# EAGLE design BoB_modul (EAGLE 7.4.0)
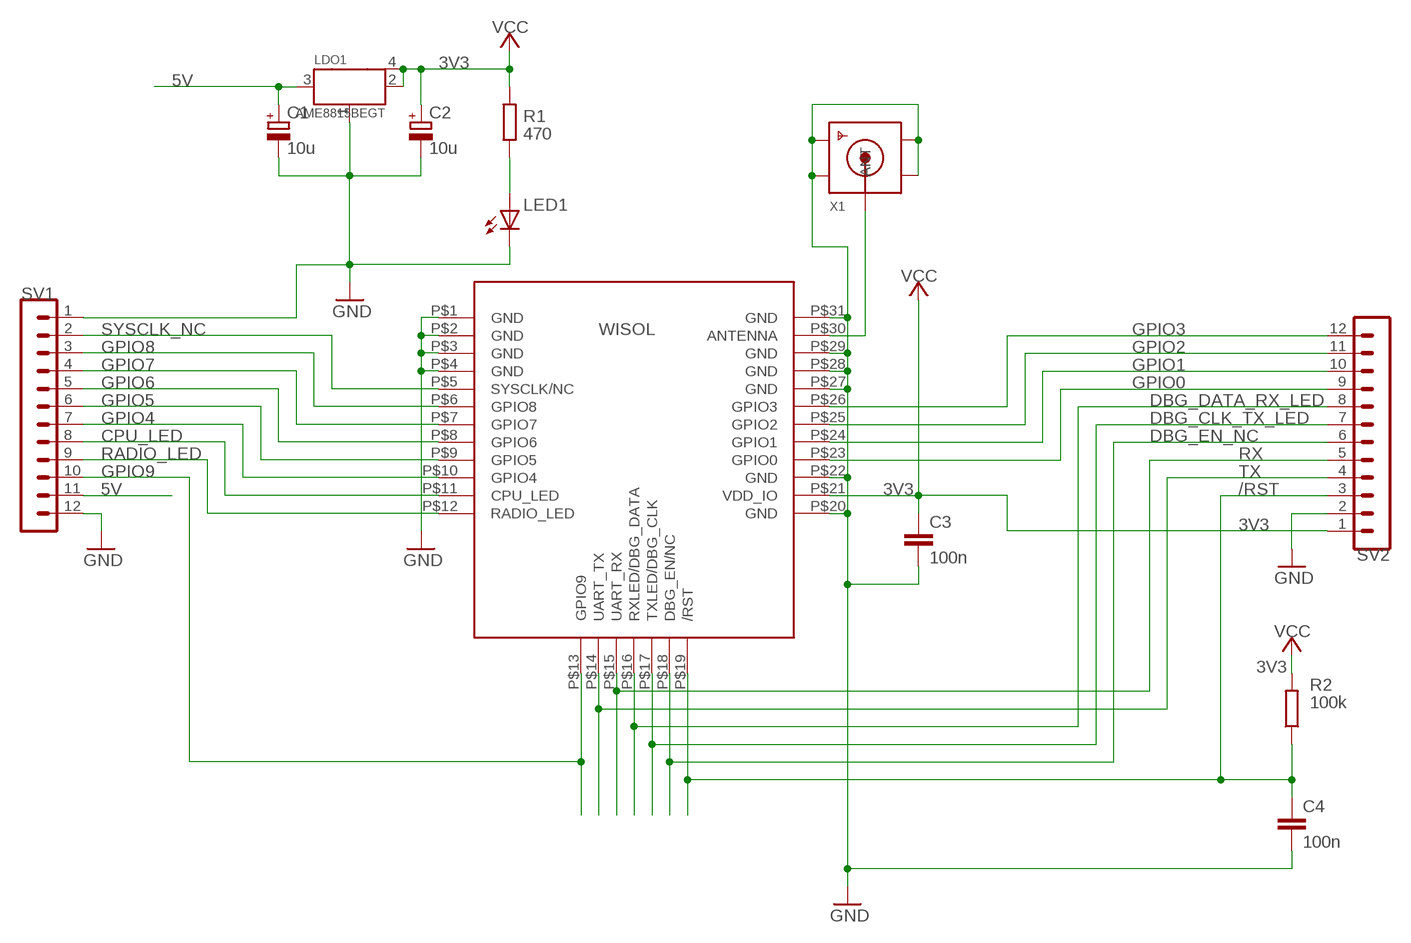
[diagram p0: schematic, sheet 1]

## Parts
C1  10u  CPOL-EUA/3216-18R  [A/3216-18R]
C2  10u  CPOL-EUA/3216-18R  [A/3216-18R]
C3  100n  C-EUC0603K  [C0603K]
C4  100n  C-EUC0603K  [C0603K]
LDO1  AME8815BEGT  [SOT223]
LED1  LEDCHIPLED_0603  [CHIPLED_0603]
R1  470  R-EU_R0603  [R0603]
R2  100k  R-EU_R0603  [R0603]
SV1  MA12-1  [MA12-1]
SV2  MA12-1  [MA12-1]
WSSFM10  SFM10  WSSFM10'HANDSOLDER'  [WSSFM10]
X1  SMACONNECTOR_EDGE_UFL  [SMA_EDGELAUNCH_UFL]

## Nets
3V3: C2.+ C3.1 LDO1.2 LDO1.4 R1.2 R2.2 SV2.1 WSSFM10.P$21(VDD_IO) ; supply symbol labelled VCC
5V: C1.+ LDO1.3 SV1.11
/RST: C4.1 R2.1 SV2.3 WSSFM10.P$19(/RST)
CPU_LED: SV1.8 WSSFM10.P$11(CPU_LED)
DBG_CLK_TX_LED: SV2.7 WSSFM10.P$17(TXLED/DBG_CLK)
DBG_DATA_RX_LED: SV2.8 WSSFM10.P$16(RXLED/DBG_DATA)
DBG_EN_NC: SV2.6 WSSFM10.P$18(DBG_EN/NC)
GND: C1.- C2.- C3.2 C4.2 LDO1.1 LED1.C SV1.1 SV1.12 SV2.2 WSSFM10.P$1(GND) WSSFM10.P$2(GND) WSSFM10.P$3(GND) WSSFM10.P$4(GND) WSSFM10.P$20(GND) WSSFM10.P$22(GND) WSSFM10.P$27(GND) WSSFM10.P$28(GND) WSSFM10.P$29(GND) WSSFM10.P$31(GND) X1.GND@1(GND1) X1.GND@2(GND2) X1.GND@3(GND3) X1.GND@4(GND4)
GPIO0: SV2.9 WSSFM10.P$23(GPIO0)
GPIO1: SV2.10 WSSFM10.P$24(GPIO1)
GPIO2: SV2.11 WSSFM10.P$25(GPIO2)
GPIO3: SV2.12 WSSFM10.P$26(GPIO3)
GPIO4: SV1.7 WSSFM10.P$10(GPIO4)
GPIO5: SV1.6 WSSFM10.P$9(GPIO5)
GPIO6: SV1.5 WSSFM10.P$8(GPIO6)
GPIO7: SV1.4 WSSFM10.P$7(GPIO7)
GPIO8: SV1.3 WSSFM10.P$6(GPIO8)
GPIO9: SV1.10 WSSFM10.P$13(GPIO9)
N$1: LED1.A R1.1
N$2: WSSFM10.P$30(ANTENNA) X1.P(ANT)
RADIO_LED: SV1.9 WSSFM10.P$12(RADIO_LED)
RX: SV2.5 WSSFM10.P$15(UART_RX)
SYSCLK_NC: SV1.2 WSSFM10.P$5(SYSCLK/NC)
TX: SV2.4 WSSFM10.P$14(UART_TX)

## Library data of the parts
C1 C2 = resistor:CPOL-EU: POLARIZED CAPACITOR, European symbol
C3 C4 = resistor:C-EU: CAPACITOR, European symbol
LDO1 = _Jochen_2016-10-02:AME8815BEGT
LED1 = led:LED: LED OSRAM: - CHIPLED LG R971, LG N971, LY N971, LG Q971, LY Q971, LO R971, LY R971 LH N974, LH R974 LS Q976, LO Q976, LY Q976 LO Q996 - Hyper CHIPLED LW Q18S LB Q993, LB Q99A, LB R99A - SideLED LS A670, LO A670, LY A670, LG A670, LP A670 LB A673, LV A673, LT A673, LW A673 LH A674 LY A675 LS A676, LA A676, LO A676, LY A676, LW A676 LS A679, LY A679, LG A679 - Hyper Micro SIDELED® LS Y876, LA Y876, LO Y876, LY Y876 LT Y87S - SmartLED LW L88C, LW L88S LB L89C, LB L89S, LG L890 LS L89K, LO L89K, LY L89K LS L896, LA L896, LO L896, LY L896 - TOPLED LS T670, LO T670, LY T670, LG T670, LP T670 LSG T670, LSP T670, LSY T670, LOP T670, LYG T670 LG T671, LOG T671, LSG T671 LB T673, LV T673, LT T673, LW T673 LH T674 LS T676, LA T676, LO T676, LY T676, LB T676, LH T676, LSB T676, LW T676 LB T67C, LV T67C, LT T67C, LS T67K, LO T67K, LY T67K, LW E67C LS E67B, LA E67B, LO E67B, LY E67B, LB E67C, LV E67C, LT E67C LW T67C LS T679, LY T679, LG T679 LS T770, LO T770, LY T770, LG T770, LP T770 LB T773, LV T773, LT T773, LW T773 LH T774 LS E675, LA E675, LY E675, LS T675 LS T776, LA T776, LO T776, LY T776, LB T776 LHGB T686 LT T68C, LB T68C - Hyper Mini TOPLED® LB M676 - Mini TOPLED Santana® LG M470 LS M47K, LO M47K, LY M47K Source: http://www.osram.convergy.de LUXEON: - LUMILED® LXK2-PW12-R00, LXK2-PW12-S00, LXK2-PW14-U00, LXK2-PW14-V00 LXK2-PM12-R00, LXK2-PM12-S00, LXK2-PM14-U00 LXK2-PE12-Q00, LXK2-PE12-R00, LXK2-PE12-S00, LXK2-PE14-T00, LXK2-PE14-U00 LXK2-PB12-K00, LXK2-PB12-L00, LXK2-PB12-M00, LXK2-PB14-N00, LXK2-PB14-P00, LXK2-PB14-Q00 LXK2-PR12-L00, LXK2-PR12-M00, LXK2-PR14-Q00, LXK2-PR14-R00 LXK2-PD12-Q00, LXK2-PD12-R00, LXK2-PD12-S00 LXK2-PH12-R00, LXK2-PH12-S00 LXK2-PL12-P00, LXK2-PL12-Q00, LXK2-PL12-R00 Source: www.luxeon.com KINGBRIGHT: KA-3528ASYC Source: www.kingbright.com
R1 R2 = resistor:R-EU_: RESISTOR, European symbol
SV1 SV2 = con-lstb:MA12-1: PIN HEADER; OC_FARNELL: unknown; OC_NEWARK: unknown
WSSFM10 = WiSOL:WSSFM10: WiSOL WSSFM10 Sigfox Module with PCB Footprint to enable handsolder
X1 = adafruit_microbuilder:SMACONNECTOR: SMA Connector 90° DIP SMA Connector, 50 Ohm (4UConnector: 07259)

## Board
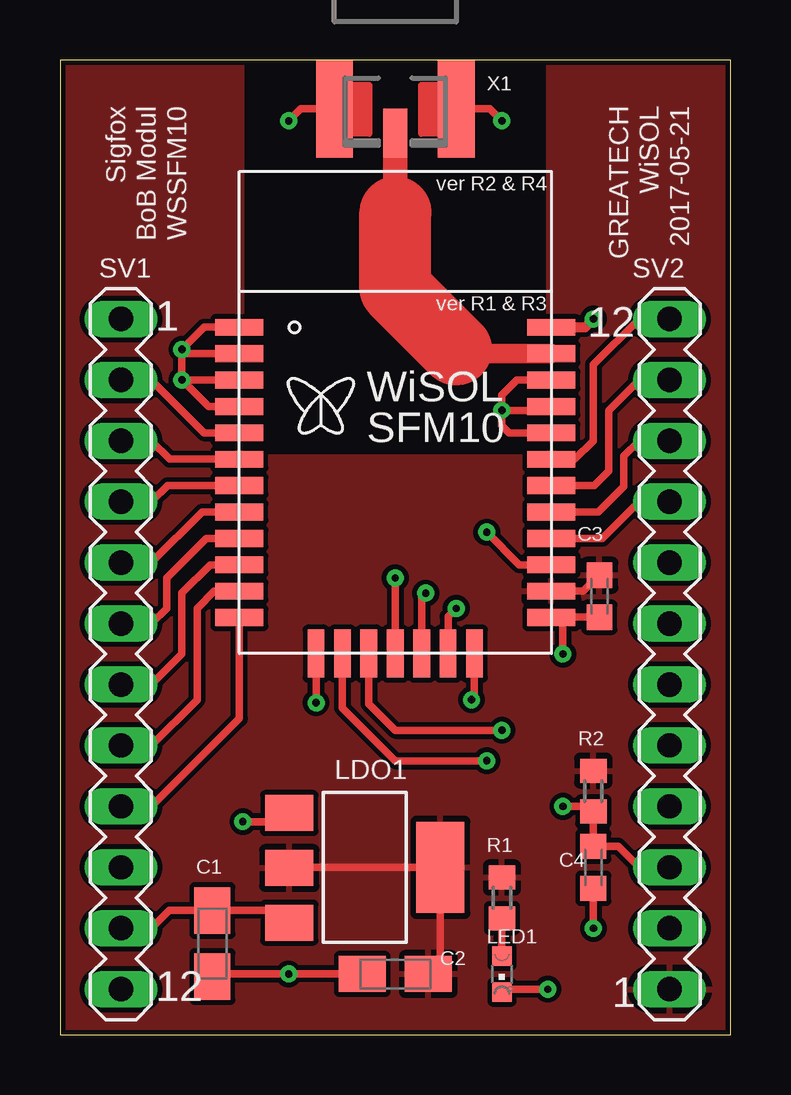
[diagram p1: board, top side]
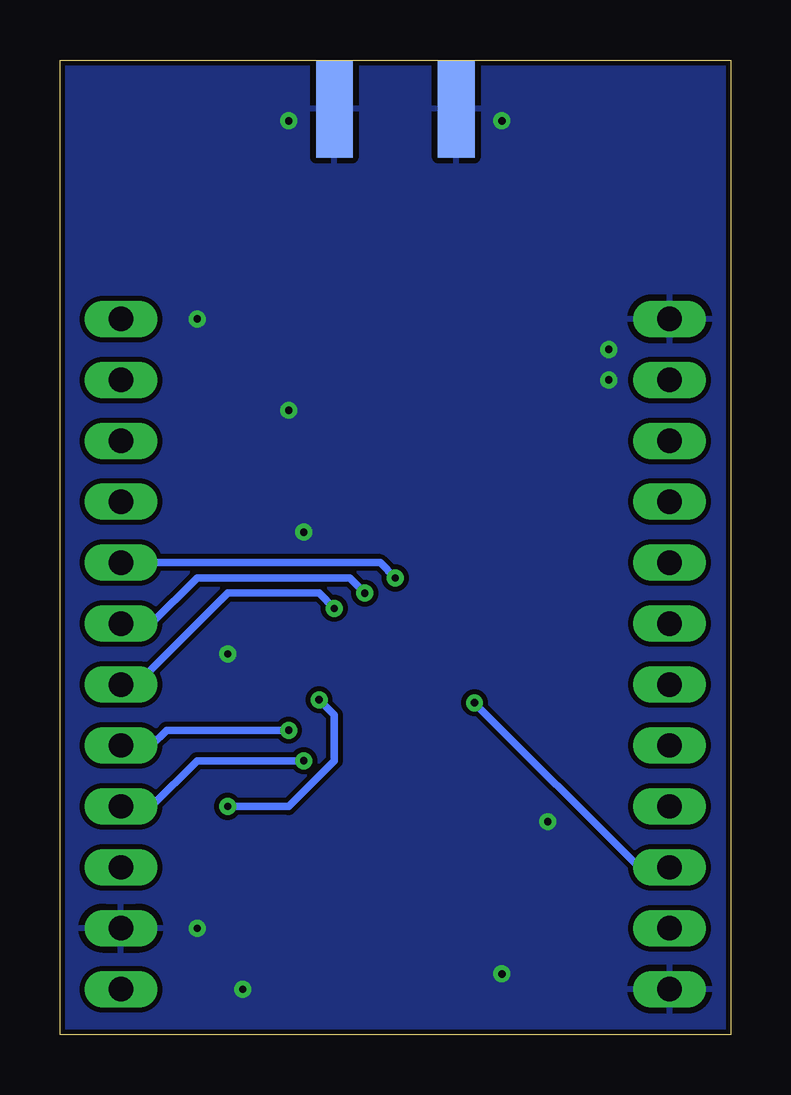
[diagram p2: board, bottom side, seen from below]

Size 27.94 x 40.64 mm. Coordinates in mm from the lower left corner, seen from the top.
Outline: 0,0 27.94,0 27.94,40.64 0,40.64 0,0
Copper layers (1*16): Top 0.035mm / dielectric 1.5mm / Bottom 0.035mm
Design rules "default *": minimum track width 10mil, minimum drill 24mil, track to track 8mil, track to pad 8mil, pad to pad 8mil, via to via 8mil, smd to smd 8mil, copper to edge 8mil, drill to drill 8mil, minimum pad ring 10mil, minimum via ring 8mil, stop-mask expansion 4mil, vias tented up to drill 0mil, thermal gap 10mil

### Footprints (pad centres in the part's own frame; a part is rotated, then mirrored left to right if it is on the bottom)
A/3216-18R = smd 1.95 x 1.5: + 1.375,0; - -1.375,0
C0603K = smd 1.05 x 1.08: 1 -0.875,0; 2 0.875,0
SOT223 = smd 1.499 x 2.007: 1 -2.261,-3.15; 2 0.025,-3.15; 3 2.311,-3.15 | smd 3.81 x 2.007: 4 0,3.15
CHIPLED_0603 = smd 0.8 x 0.8: A 0,-0.75; C 0,0.75
R0603 = smd 1 x 1.1: 1 -0.85,0; 2 0.85,0
MA12-1 = drill 1.016 long: 1 -13.97,0; 2 -11.43,0; 3 -8.89,0; 4 -6.35,0; 5 -3.81,0; 6 -1.27,0; 7 1.27,0; 8 3.81,0; 9 6.35,0; 10 8.89,0; 11 11.43,0; 12 13.97,0
WSSFM10 = smd 2 x 0.7: P$1 -6.5,6; P$2 -6.5,4.9; P$3 -6.5,3.8; P$4 -6.5,2.7; P$5 -6.5,1.6; P$6 -6.5,0.5; P$7 -6.5,-0.6; P$8 -6.5,-1.7; P$9 -6.5,-2.8; P$10 -6.5,-3.9; P$11 -6.5,-5; P$12 -6.5,-6.1; P$20 6.5,-6.1; P$21 6.5,-5; P$22 6.5,-3.9; P$23 6.5,-2.8; P$24 6.5,-1.7; P$25 6.5,-0.6; P$26 6.5,0.5; P$27 6.5,1.6; P$28 6.5,2.7; P$29 6.5,3.8; P$30 6.5,4.9; P$31 6.5,6 | smd 0.7 x 2: P$13 -3.3,-7.6; P$14 -2.2,-7.6; P$15 -1.1,-7.6; P$16 0,-7.6; P$17 1.1,-7.6; P$18 2.2,-7.6; P$19 3.3,-7.6
SMA_EDGELAUNCH_UFL = smd 4.064 x 1.524: GND@1 2.032,-2.54; GND@2 2.032,2.54 | smd 4.064 x 1.524 bottom: GND@3 2.032,2.54; GND@4 2.032,-2.54 | smd 2.032 x 1.016: P 3.048,0

### Placement (x,y rotation side)
C1  6.35,3.81 90 top
C2  13.97,2.54 0 top
C3  22.48,18.29 270 top
C4  22.23,6.99 270 top
LDO1  12.7,6.99 270 top
LED1  18.41,2.54 180 top
R1  18.41,5.71 90 top
R2  22.23,10.16 90 top
SV1  2.54,15.88 270 top
SV2  25.4,15.88 90 top
WSSFM10  13.97,23.5 0 top
X1  13.97,40.64 270 top

### Tracks (layer width: path | path; a pad name or v marks a point on that pad's centre or on a via)
3V3
  Top 0.305: WSSFM10.P$21 21.81,18.5 C3.1 | LDO1.2 9.58,6.99 LDO1.4 15.85,3.04 C2.+
  pour Top (isolate 0.203): 27.94,0 0,0 0,40.64 7.62,40.64 7.62,24.13 20.32,24.13 20.32,40.64 27.94,40.64
5V
  Top 0.305: SV1.11 3.81,4.45 4.55,5.18 C1.+ 9.04,5.18 LDO1.3
/RST  (via drill 0.3)
  Top 0.305: WSSFM10.P$19 17.27,14.1 v17.14,13.97 | v20.95,9.53 22.01,9.53 R2.1 C4.1 23.25,7.86 24.13,6.99 SV2.3
  Bottom 0.305: v17.14,13.97 16.51,13.34 16.51,11.43 18.41,9.53 v20.95,9.53
CPU_LED
  Top 0.305: SV1.8 3.81,12.06 5.71,13.97 5.71,17.78 6.43,18.5 WSSFM10.P$11
DBG_CLK_TX_LED  (via drill 0.3)
  Top 0.305: v15.24,18.41 15.07,18.25 WSSFM10.P$17
  Bottom 0.305: v15.24,18.41 15.88,19.05 22.23,19.05 24.13,17.14 SV2.7
DBG_DATA_RX_LED  (via drill 0.3)
  Top 0.305: v13.97,19.05 WSSFM10.P$16
  Bottom 0.305: v13.97,19.05 14.61,19.68 SV2.8
DBG_EN_NC  (via drill 0.3)
  Top 0.305: v16.51,17.78 16.17,17.44 WSSFM10.P$18
  Bottom 0.305: v16.51,17.78 17.14,18.41 20.95,18.41 24.77,14.61 SV2.6
GND  (via drill 0.3)
  Top 0.305: C3.2 20.49,17.41 WSSFM10.P$20 20.95,17.39 v20.95,15.88 | LDO1.1 9.2,8.89 v7.62,8.89 | C2.- v9.53,2.54 6.46,2.54 C1.- | C4.2 v22.23,4.45 | v20.32,1.91 18.53,1.91 LED1.C | WSSFM10.P$22 19.14,19.59 v17.78,20.95 | WSSFM10.P$29 19.04,27.3 18.41,26.67 v18.41,26.04 | v18.41,26.04 18.41,25.4 18.72,25.09 WSSFM10.P$27 | WSSFM10.P$28 20.31,26.04 v18.41,26.04 | WSSFM10.P$31 20.04,29.5 | WSSFM10.P$4 6.19,26.2 v5.09,27.3 | v5.08,28.57 v5.08,27.3 v5.09,27.3 | v5.08,28.57 6,29.5 WSSFM10.P$1 | WSSFM10.P$2 5.26,28.39 v5.08,28.57 | WSSFM10.P$3 v5.09,27.3 | X1.GND@2 17.91,38.61 v18.41,38.1 | X1.GND@4 10.03,38.61 v9.53,38.1
  Top 0.406: 20.04,29.5 21.88,29.5 v22.23,29.84
  pour Bottom (isolate 0.203): 0,40.64 27.94,40.64 27.94,0 0,0
GPIO0
  Top 0.305: WSSFM10.P$23 22.6,20.7 24.13,22.23 SV2.9
GPIO1
  Top 0.305: WSSFM10.P$24 22.43,21.8 23.5,22.86 23.5,24.13 24.13,24.77 SV2.10
GPIO2
  Top 0.305: WSSFM10.P$25 22.26,22.89 22.86,23.5 22.86,26.04 24.13,27.3 SV2.11
GPIO3
  Top 0.305: WSSFM10.P$26 21.45,24 22.23,24.77 22.23,27.94 24.13,29.84 SV2.12
GPIO4
  Top 0.305: SV1.7 3.81,14.61 5.08,15.88 5.08,18.41 6.26,19.59 WSSFM10.P$10
GPIO5
  Top 0.305: SV1.6 3.81,17.14 4.45,17.78 4.45,19.05 6.09,20.7 WSSFM10.P$9
GPIO6
  Top 0.305: SV1.5 3.81,19.68 5.92,21.8 WSSFM10.P$8
GPIO7
  Top 0.305: SV1.4 3.81,22.23 4.48,22.89 WSSFM10.P$7
GPIO8
  Top 0.305: SV1.3 3.81,24.77 4.58,24 WSSFM10.P$6
GPIO9  (via drill 0.3)
  Top 0.305: v10.67,13.85 WSSFM10.P$13
  Bottom 0.305: SV1.10 3.81,6.99 v10.67,13.85
N$1
  Top 0.305: R1.1 LED1.A
N$2
  Top 0.813: WSSFM10.P$30 16.69,28.39 16.51,28.57
  Top 1.016: 13.97,34.29 X1.P
  Top 3: 16.51,28.57 13.97,31.11 13.97,34.29
RADIO_LED
  Top 0.305: SV1.9 3.81,9.53 7.47,13.19 WSSFM10.P$12
RX  (via drill 0.3)
  Top 0.305: WSSFM10.P$15 12.87,13.8 13.97,12.7 v18.41,12.7
  Bottom 0.305: v18.41,12.7 23.5,12.7 24.13,12.06 SV2.5
SYSCLK_NC
  Top 0.305: SV1.2 3.81,27.3 6.02,25.09 WSSFM10.P$5
TX  (via drill 0.3)
  Top 0.305: WSSFM10.P$14 11.77,13.63 13.97,11.43 v17.78,11.43
  Bottom 0.305: v17.78,11.43 22.23,11.43 24.13,9.53 SV2.4

### Text on the board
tNames: Sigfox | BoB Modul | WSSFM10 | GREATECH | WiSOL | 2017-05-21